# Altium project PCB_Project_1.PrjPcb
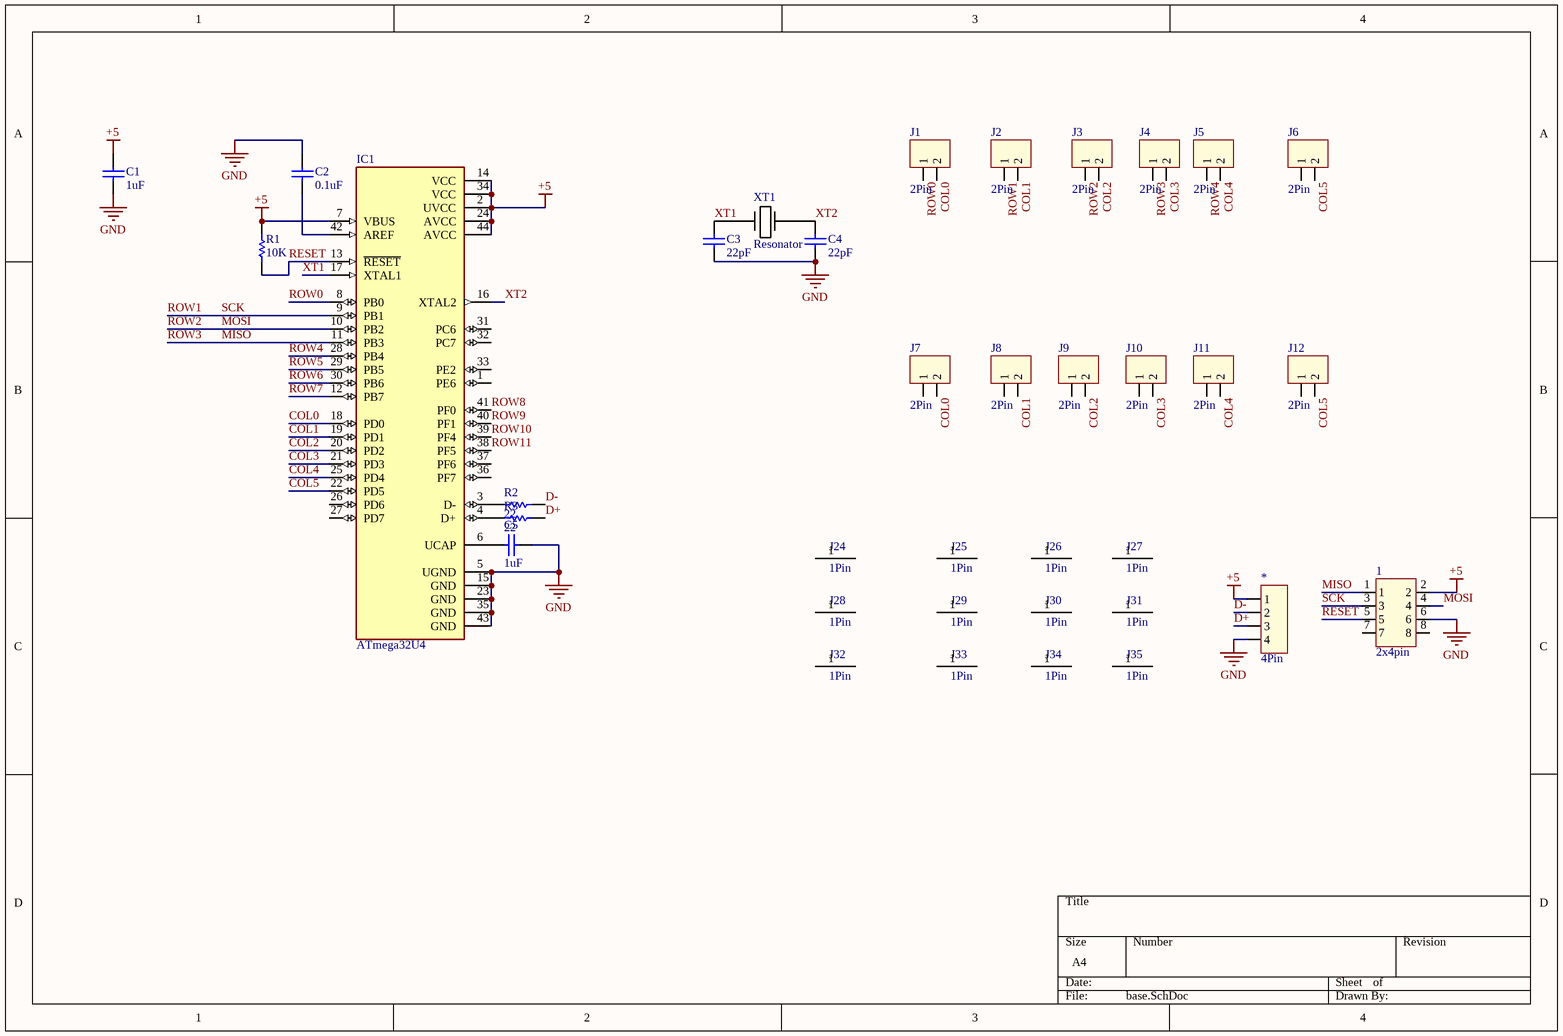
[diagram p0: base.SchDoc]
1 sheet, 36 parts. Net scope: global (net labels, ports and power ports of the same name join across sheets).
Board file: PCB1.PcbDoc

## Sheet base.SchDoc
size A4

### Parts
1  2x4pin  [4pin_slot]
*  4Pin  [XH2.54-4pin]
C1  1uF  [C0805]
C2  0.1uF  [C0805]
C3  22pF  [C0805]
C4  22pF  [C0805]
C5  1uF  [C0805]
IC1  ATmega32U4  [TQFP-44]
J1  2Pin  [TH2.54-2pin]
J2  2Pin  [TH2.54-2pin]
J3  2Pin  [TH2.54-2pin]
J4  2Pin  [TH2.54-2pin]
J5  2Pin  [TH2.54-2pin]
J6  2Pin  [TH2.54-2pin]
J7  2Pin  [TH2.54-2pin]
J8  2Pin  [TH2.54-2pin]
J9  2Pin  [TH2.54-2pin]
J10  2Pin  [TH2.54-2pin]
J11  2Pin  [TH2.54-2pin]
J12  2Pin  [TH2.54-2pin]
J24  1Pin  [1Pin]
J25  1Pin  [1Pin]
J26  1Pin  [1Pin]
J27  1Pin  [1Pin]
J28  1Pin  [1Pin]
J29  1Pin  [1Pin]
J30  1Pin  [1Pin]
J31  1Pin  [1Pin]
J32  1Pin  [1Pin]
J33  1Pin  [1Pin]
J34  1Pin  [1Pin]
J35  1Pin  [1Pin]
R1  10K  [R0805]
R2  22  [R0805]
R3  22  [R0805]
XT1  Resonator  [Resonator]

### Nets
+5: 1.2 *.1 C1.2 IC1.2(UVCC) IC1.7(VBUS) IC1.14(VCC) IC1.24(AVCC) IC1.34(VCC) IC1.44(AVCC) R1.2
GND: 1.6 *.4 C1.1 C2.2 C3.1 C4.1 C5.2 IC1.5(UGND) IC1.15(GND) IC1.23(GND) IC1.35(GND) IC1.43(GND)
COL0: IC1.18(PD0) J1.2 J7.2
COL1: IC1.19(PD1) J2.2 J8.2
COL2: IC1.20(PD2) J3.2 J9.2
COL3: IC1.21(PD3) J4.2 J10.2
COL4: IC1.25(PD4) J5.2 J11.2
COL5: IC1.22(PD5) J6.2 J12.2
D+: *.3 R3.2
D-: *.2 R2.2
MISO: 1.1 IC1.11(PB3) J4.1  [also labelled ROW3]
MOSI: 1.4 IC1.10(PB2) J3.1  [also labelled ROW2]
RESET: 1.5 IC1.13(~{RESET}) R1.1
ROW0: IC1.8(PB0) J1.1
ROW1: 1.3 IC1.9(PB1) J2.1  [also labelled SCK]
ROW4: IC1.28(PB4) J5.1
ROW5: IC1.29(PB5)
ROW6: IC1.30(PB6)
ROW7: IC1.12(PB7)
ROW8: IC1.41(PF0)
ROW9: IC1.40(PF1)
ROW10: IC1.39(PF4)
ROW11: IC1.38(PF5)
XT1: C3.2 IC1.17(XTAL1) XT1.1
XT2: C4.2 IC1.16(XTAL2) XT1.2
NetC2_1: C2.1 IC1.42(AREF)
NetC5_1: C5.1 IC1.6(UCAP)
NetIC1_3: IC1.3(D-) R2.1
NetIC1_4: IC1.4(D+) R3.1

Not connected (* = marked no-connect by the designer): 1 7 8; IC1 1(PE6) 26(PD6) 27(PD7) 31(PC6) 32(PC7) 33(PE2) 36(PF7) 37(PF6); J6 1; J7 1; J8 1; J9 1; J10 1; J11 1; J12 1; J24 1(0); J25 1(0); J26 1(0); J27 1(0); J28 1(0); J29 1(0); J30 1(0); J31 1(0); J32 1(0); J33 1(0); J34 1(0); J35 1(0)

### Library data of the parts
C1-C5 = Cap: value: *
R1-R3 = Resistor: value: *